# Altium schematic sheet Interface.SchDoc
size A4
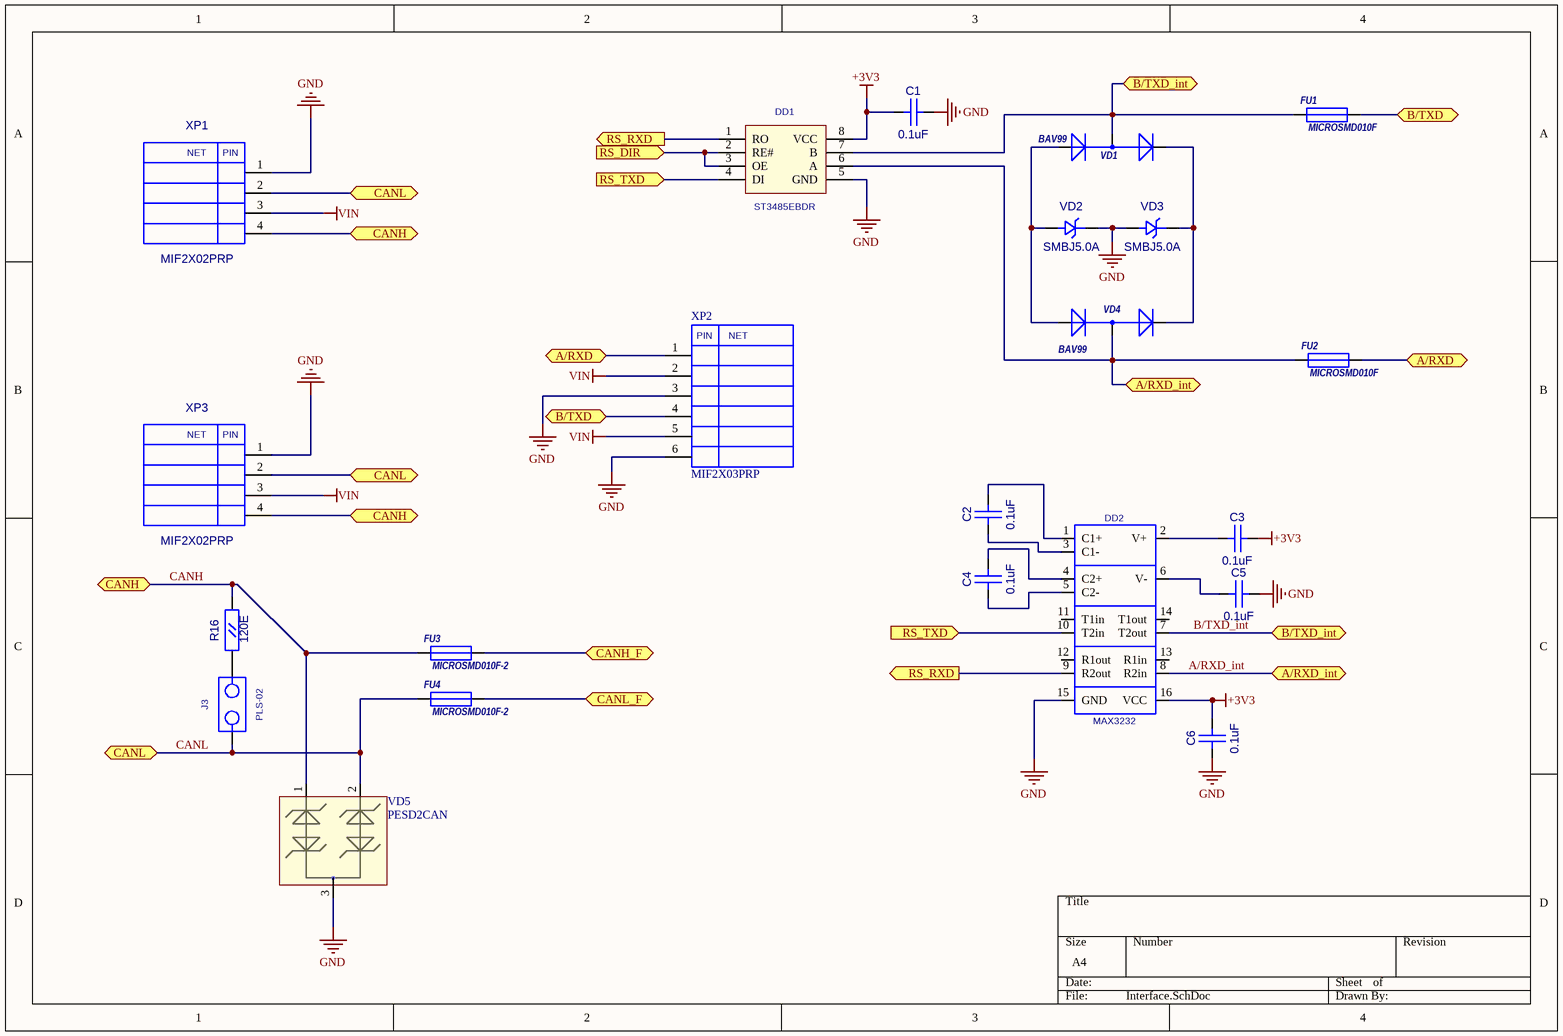
[diagram p0: Interface.SchDoc]

## Parts
C1  0.1uF  [CC0603]
C2  0.1uF  [CC0603]
C3  0.1uF  [CC0603]
C4  0.1uF  [CC0603]
C5  0.1uF  [CC0603]
C6  0.1uF  [CC0603]
DD1  ST3485EBDR  [SO-8]
DD2  MAX3232  [SO16_M]
FU1  MICROSMD010F  [RC1210]
FU2  MICROSMD010F  [RC1210]
FU3  MICROSMD010F-2  [RC1210]
FU4  MICROSMD010F-2  [RC1210]
J3  PLS-02  [PLS-02]
R16  120E  [RC0805]
VD1  BAV99  [SOT-23(GSD)]
VD2  SMBJ5.0A  [SMB]
VD3  SMBJ5.0A  [SMB]
VD4  BAV99  [SOT-23(GSD)]
VD5  PESD2CAN  [SOT-23(123)]
XP1  MIF2X02PRP  [MIF2X02PRP]
XP2  MIF2X03PRP  [MIF2X03PRP]
XP3  MIF2X02PRP  [MIF2X02PRP]

## Ports
A/RXD, A/RXD_int, B/TXD, B/TXD_int, CANH, CANH (bidir), CANH_F, CANL, CANL (bidir), CANL_F, RS_DIR (in), RS_RXD (out), RS_TXD (in)

## Nets
+3V3: C1.1(A) C3.2(B) C6.2(B) DD1.8(VCC) DD2.16(VCC)
GND: C1.2(B) C5.2(B) C6.1(A) DD1.5(GND) DD2.15(GND) VD2.2(K) VD3.1(A) VD5.3 XP1.1 XP2.3 XP2.6 XP3.1
VIN: XP1.3 XP2.2 XP2.5 XP3.3
A/RXD: FU2.2 XP2.1 ; port A/RXD
A/RXD_int: DD1.6(A) DD2.8(R2in) FU2.1 VD4.3(AK) ; port A/RXD_int
B/TXD: FU1.2 XP2.4 ; port B/TXD
B/TXD_int: DD1.7(B) DD2.7(T2out) FU1.1 VD1.3(AK) ; port B/TXD_int
CANH: FU3.1 R16.2(B) VD5.1 XP1.4 XP3.4 ; port CANH
CANH_F: FU3.2 ; port CANH_F
CANL: FU4.1 J3.1 VD5.2 XP1.2 XP3.2 ; port CANL
CANL_F: FU4.2 ; port CANL_F
RS_DIR: DD1.2(RE#) DD1.3(OE) ; port RS_DIR
RS_RXD: DD1.1(RO) DD2.9(R2out) ; port RS_RXD
RS_TXD: DD1.4(DI) DD2.10(T2in) ; port RS_TXD
NetC2_1: C2.1(A) DD2.3(C1-)
NetC2_2: C2.2(B) DD2.1(C1+)
NetC3_1: C3.1(A) DD2.2(V+)
NetC4_1: C4.1(A) DD2.5(C2-)
NetC4_2: C4.2(B) DD2.4(C2+)
NetC5_1: C5.1(A) DD2.6(V-)
NetJ3_2: J3.2 R16.1(A)
NetVD1_1: VD1.1(A) VD2.1(A) VD4.1(A)
NetVD1_2: VD1.2(K) VD3.2(K) VD4.2(K)

Not connected (* = marked no-connect by the designer): DD2 11(T1in) 12(R1out) 13(R1in) 14(T1out)

## Notes on the sheet
- (in symbol MIF2X02PRP) NET; PIN
- (in symbol MIF2X03PRP) PIN; NET

## Library data of the parts
C1-C6 = CC0603: Value: 0.1uF
DD1 = SP485: Value: ST3485EBDR
DD2 = ST232BD/CD: Value: MAX3232
FU1-FU4 = MICROSMD
  FU1 FU2: Value: MICROSMD010F
  FU3 FU4: Value: MICROSMD010F-2
R16 = RC0805: Value: 120E
VD1 VD4 = BAV99: 1.0 Ampere General Purpose Rectifier; ComponentField6: Published 8-Jun-2000, Modified 11-July-2000: SIM Model Added.; Value: *
VD2 VD3 = SMBJ: Value: SMBJ5.0A
VD5 = PESD2CAN: TVS for CAN
J3 = PLS-02: Value: *
XP1 XP3 = MIF2X02PRP: Value: *
XP2 = MIF2X03PRP: Value: *